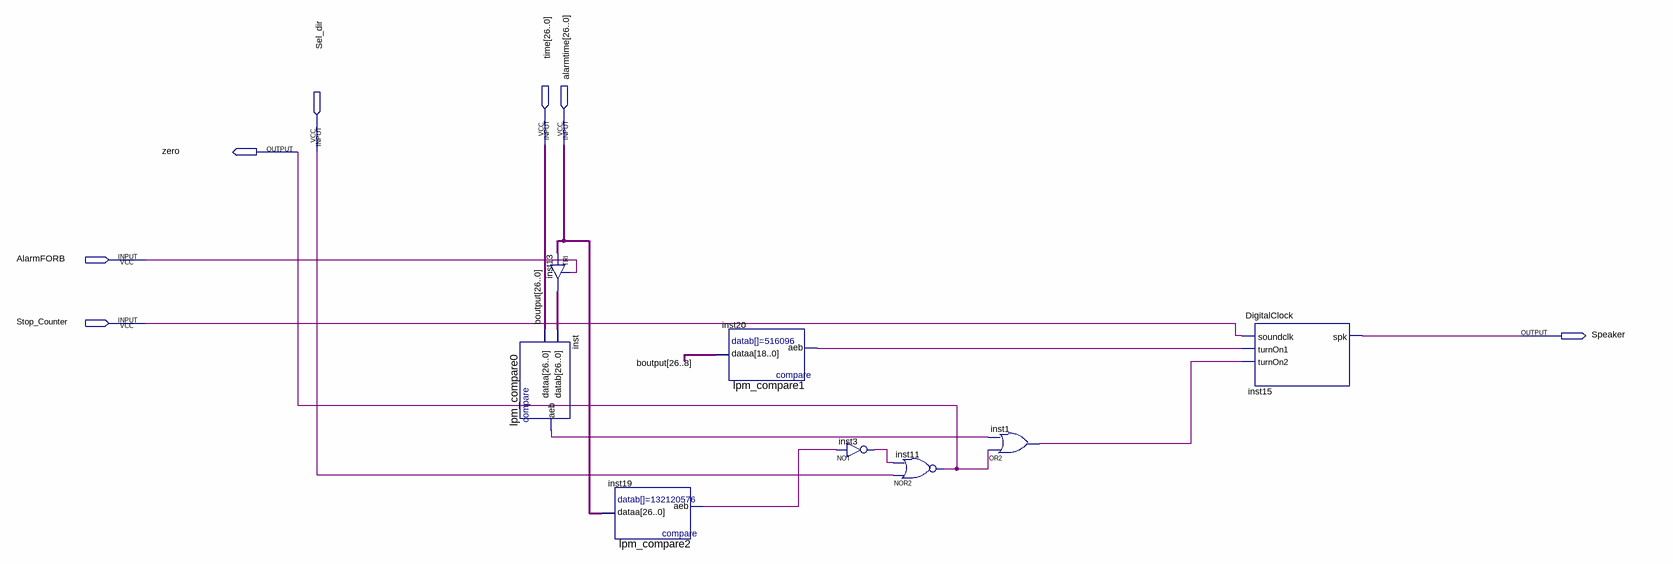
[diagram p0: schematic sheet]
// Quartus schematic SoundCtr.bdf as structural Verilog: 8 symbols, 7 pins
module SoundCtr (
  input  [26:0] \time ,
  input  [26:0] alarmtime,
  input  Sel_dir,
  input  AlarmFORB,
  input  Stop_Counter,
  output zero,
  output Speaker
);

  wire inst1_out, inst3_out, inst19_aeb, inst20_aeb, inst_aeb;
  wire [26:0] inst13_out;

  TRI inst13[26:0] (.IN(alarmtime), .OE(AlarmFORB), .OUT(inst13_out));
  lpm_compare0 inst (.dataa(\time ), .datab(inst13_out), .aeb(inst_aeb));
  lpm_compare2 inst19 (.dataa(alarmtime), .aeb(inst19_aeb));
  lpm_compare1 inst20 (.dataa(\time [26:8]), .aeb(inst20_aeb));
  not inst3 (inst3_out, inst19_aeb);
  nor inst11 (zero, Sel_dir, inst3_out);
  or inst1 (inst1_out, zero, inst_aeb);
  DigitalClock inst15 (.soundclk(Stop_Counter), .turnOn1(inst20_aeb), .turnOn2(inst1_out), .spk(Speaker));

  // Other names for the same wires on the sheet: boutput[26:0] = \time 
endmodule
